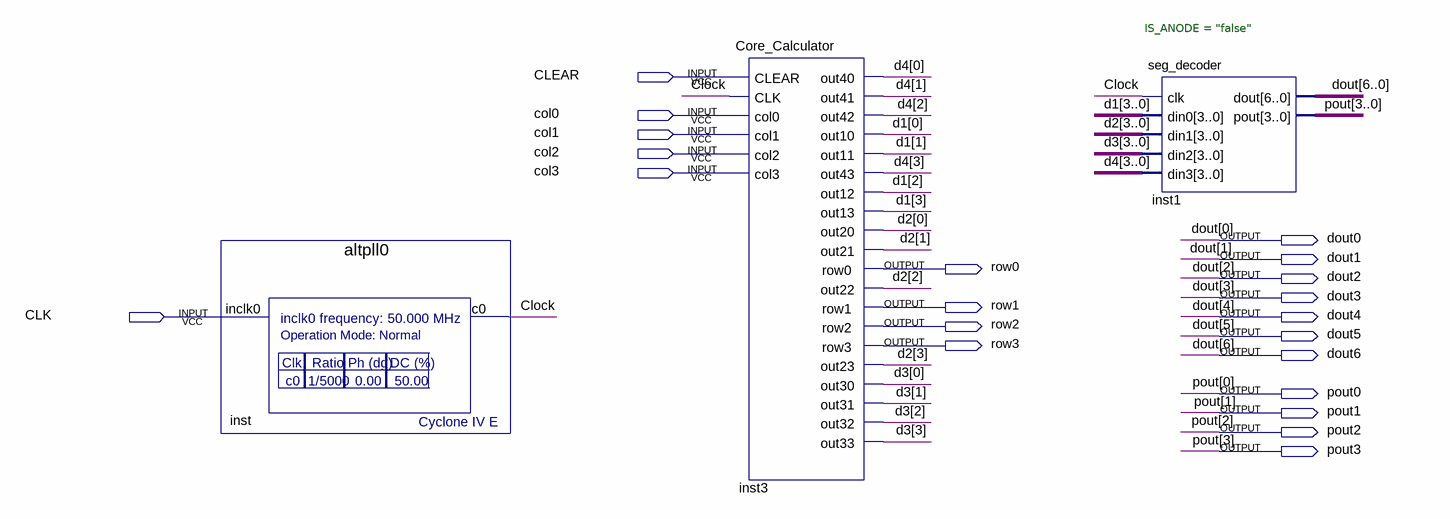
[diagram p0: schematic sheet]
// Quartus schematic Full_Calculator.bdf as structural Verilog: 3 symbols, 21 pins
module Full_Calculator (
  input  CLEAR,
  input  col0,
  input  col1,
  input  col2,
  input  col3,
  input  CLK,
  output dout0,
  output dout1,
  output row0,
  output dout2,
  output dout3,
  output row1,
  output dout4,
  output row2,
  output dout5,
  output row3,
  output dout6,
  output pout0,
  output pout1,
  output pout2,
  output pout3
);

  wire Clock;
  wire [3:0] d1, d2, d3, d4;

  altpll0 inst (.inclk0(CLK), .c0(Clock));
  Core_Calculator inst3 (
    .CLEAR(CLEAR), .CLK(Clock), .col0(col0), .col1(col1), .col2(col2), .col3(col3), .out40(d4[0]),
    .out41(d4[1]), .out42(d4[2]), .out10(d1[0]), .out11(d1[1]), .out43(d4[3]), .out12(d1[2]), .out13(d1[3]),
    .out20(d2[0]), .out21(d2[1]), .row0(row0), .out22(d2[2]), .row1(row1), .row2(row2), .row3(row3),
    .out23(d2[3]), .out30(d3[0]), .out31(d3[1]), .out32(d3[2]), .out33(d3[3]));
  seg_decoder #(.IS_ANODE("false")) inst1 (
    .clk(Clock), .din0(d1), .din1(d2), .din2(d3), .din3(d4),
    .dout({dout6, dout5, dout4, dout3, dout2, dout1, dout0}), .pout({pout3, pout2, pout1, pout0}));
endmodule
